# Altium schematic sheet TCAN337 CANbus Transciever.SchDoc: MAX33053E CANbus Transciever
size Letter; SheetNumber: 7; SheetTotal: 18
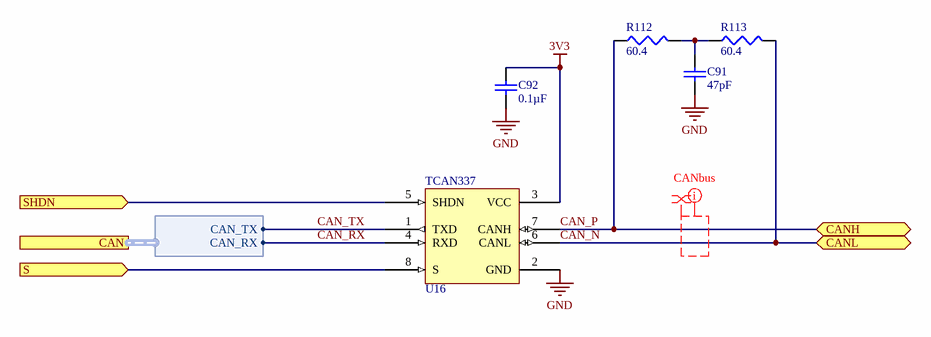
[diagram p0: TCAN337 CANbus Transciever.SchDoc]

## Parts
C91  value 47pF  [TDK-CGA2B]  (hidden comment: Cap)
C92  value 0.1µF  [TDK-CGA2B]  (hidden comment: Cap)
R112  value 60.4  [PANA-ERA2A]  (hidden comment: Res3)
R113  value 60.4  [PANA-ERA2A]  (hidden comment: Res3)
U16  TCAN337  [TI-R-PDSO-G8]

## Ports
CAN (harness MAX33053E_CAN), CANH (bidir), CANL (bidir), S (in), SHDN (in)

## Harnesses
MAX33053E_CAN: CAN_RX, CAN_TX

## Nets
3V3: C92.1 U16.3(VCC)
GND: C91.1 C92.2 U16.2(GND)
CAN_N: R113.2 U16.6(CANL) ; port CANL
CAN_P: R112.1 U16.7(CANH) ; port CANH
CAN_RX: U16.4(RXD) ; port CAN.CAN_RX
CAN_TX: U16.1(TXD) ; port CAN.CAN_TX
S: U16.8(S) ; port S
SHDN: U16.5(SHDN) ; port SHDN
NetC91_2: C91.2 R112.2 R113.1

## Layout directives
net class CANbus; rule Impedance Constraint [Min = 120.0    Max = 120.0    ]: (no net found under the mark)
differential pair: (no net found under the mark)

## Notes on the sheet
- Title
- Size:
- Date:
- Letter
- Number:
- Time:
- Revision:
- Sheet
- of
- University of Alberta
- Deptartment of Electrical
- and Computer Engineering
- Edmonton AB, Canada
- T6G 1H9
- File:

## Library data of the parts
C91 = PC-TDK-01185: CAP CER 47PF 50V NP0 0402; Manufacturer Part Number: CGA2B2NP01H470J050BA; Index: 1185; Designator: C?; Tolerance: ±5%; Published: 2016-03-16; LatestRevisionDate: 2016-03-16; LatestRevisionNote: ...; PackageReference: 0402 (1005 Metric); Publisher: AlbertaSat; PackageDescription: Radial Cap, Thru-Hole; 2 Leads; 0.3 in Pin Spacing; Part Number: PC-TDK-01185; Supplier Part Number 1: 445-12142-1-ND; Supplier 1: Digi-key; Supplier Link: http://www.digikey.ca/product-search/en?keywords=445-12142-1-ND; Voltage - Rated: 50V; Temperature Coefficient: NP0; Applications: Automotive
C92 = PC-TDK-02259: CAP CER 0.1UF 50V X7R 0402; Manufacturer Part Number: CGA2B3X7R1H104K050BB; Index: 2259; Designator: C?; Tolerance: ±10%; Published: 2016-03-16; LatestRevisionDate: 2016-03-16; LatestRevisionNote: ...; PackageReference: 0402 (1005 Metric); Publisher: AlbertaSat; PackageDescription: Radial Cap, Thru-Hole; 2 Leads; 0.3 in Pin Spacing; Part Number: PC-TDK-02259; Supplier Part Number 1: 445-6899-1-ND; Supplier 1: Digi-key; Supplier Link: http://www.digikey.ca/product-search/en?keywords=445-6899-1-ND; Voltage - Rated: 50V; Temperature Coefficient: X7R; Applications: Automotive
R112 R113 = 13829: RES SMD 60.4 OHM 0.1% 1/16W 0402; Part Number: 13829; Manufacturer Part Number: ERA-2AEB60R4X; Designator: R?; Power: 0.063W, 1/16W; Temperature Coefficient: ±25ppm/°C; Published: 8-Jun-2000; LatestRevisionDate: 29-May-2009; LatestRevisionNote: IPC-7351 Footprint Added.; PackageReference: 0402 (1005 Metric); Publisher: Altium Limited; PackageDescription: Chip Resistor, 2-Leads, Body 1.00x0.50mm, IPC Low Density; Supplier Part Number 1: P60.4DCCT-ND; Supplier 1: Digi-Key; Supplier Link: http://www.digikey.ca/product-search/en?keywords=P60.4DCCT-ND; Tolerance: ±0.1%
U16 = 78: IC TXRX CAN 3.3V SOT23-8; Part Number: 78; Manufacturer Part Number: TCAN337GDCNR; Designator: U?; Supplier Part Number 2: 595-TCAN337GDCNR; Supplier 2: Mouser; Supplier Part Number 1: 296-48971-1-ND; Supplier 1: Digi-Key; Supplier Link: #https://www.digikey.ca/product-detail/en/texas-instruments/TCAN337GDCNR/296-48971-1-ND/8635034#; PackageReference: SOT-23-8; Operating Temperature: -40°C ~ 125°C